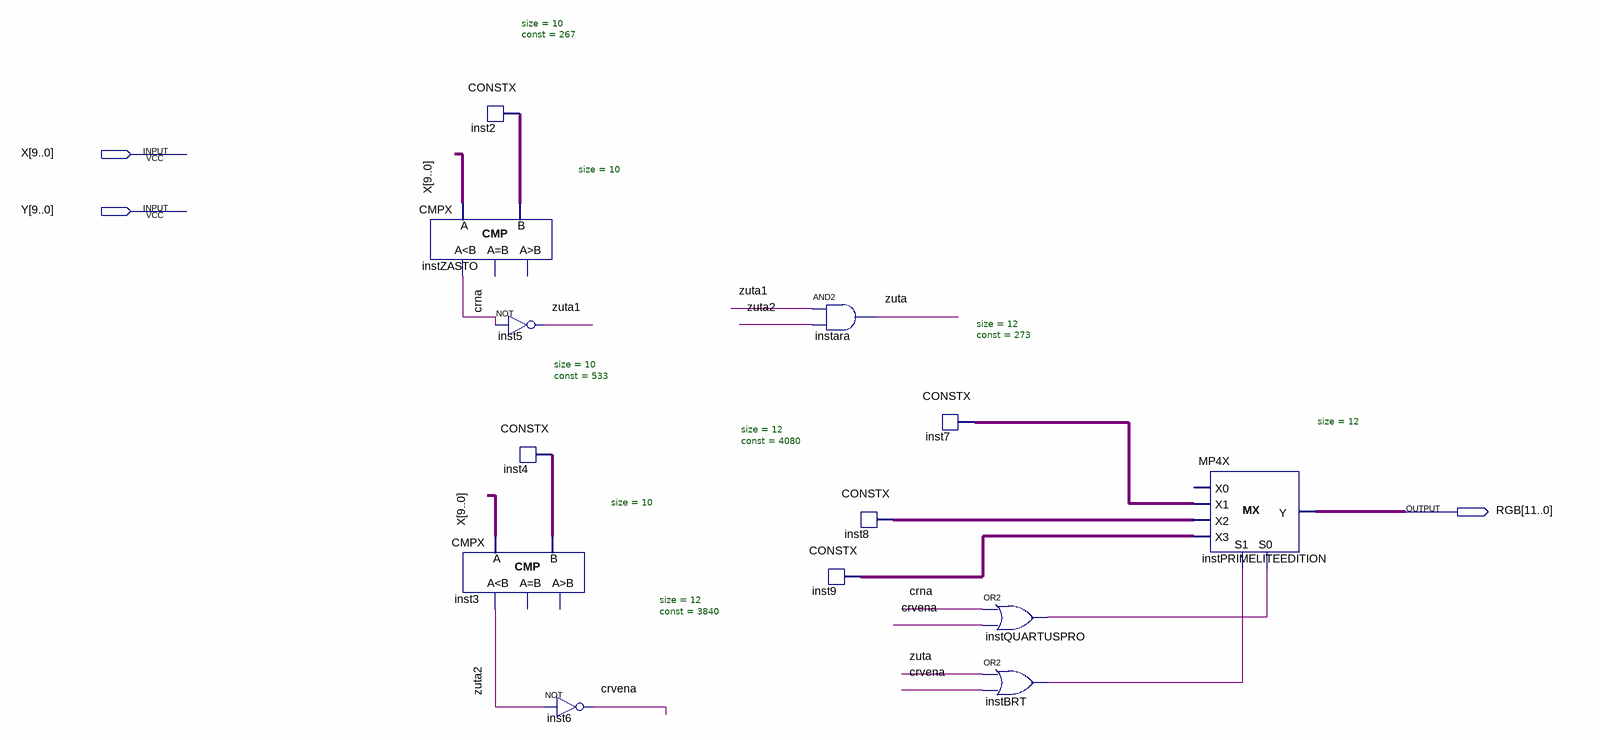
[diagram p0: schematic sheet]
// Quartus schematic belgijska.bdf as structural Verilog: 13 symbols, 3 pins
module belgijska (
  input  [9:0] X,
  input  [9:0] Y,
  output [11:0] RGB
);

  wire crna, crvena, instBRT_out, instQUARTUSPRO_out, zuta, zuta1, zuta2;
  wire [9:0] inst2_data, inst4_data;
  wire [11:0] inst7_data, inst8_data, inst9_data;

  CMPX #(.size(10)) instZASTO (.A(X), .B(inst2_data), .ls(crna));  // open: eq, gr
  CONSTX #(.size(10), .\const (267)) inst2 (.data(inst2_data));
  not inst5 (zuta1, crna);
  CONSTX #(.size(10), .\const (533)) inst4 (.data(inst4_data));
  CMPX #(.size(10)) inst3 (.A(X), .B(inst4_data), .ls(zuta2));  // open: eq, gr
  not inst6 (crvena, zuta2);
  and instara (zuta, zuta1, zuta2);
  CONSTX #(.size(12), .\const (3840)) inst9 (.data(inst9_data));
  CONSTX #(.size(12), .\const (4080)) inst8 (.data(inst8_data));
  CONSTX #(.size(12), .\const (273)) inst7 (.data(inst7_data));
  or instQUARTUSPRO (instQUARTUSPRO_out, crna, crvena);
  or instBRT (instBRT_out, zuta, crvena);
  MP4X #(.size(12)) instPRIMELITEEDITION (
    .S0(instQUARTUSPRO_out), .S1(instBRT_out), .X1(inst7_data), .X2(inst8_data), .X3(inst9_data), .Y(RGB));  // open: X0
endmodule
